# EAGLE design HEA (EAGLE 9.6.2)
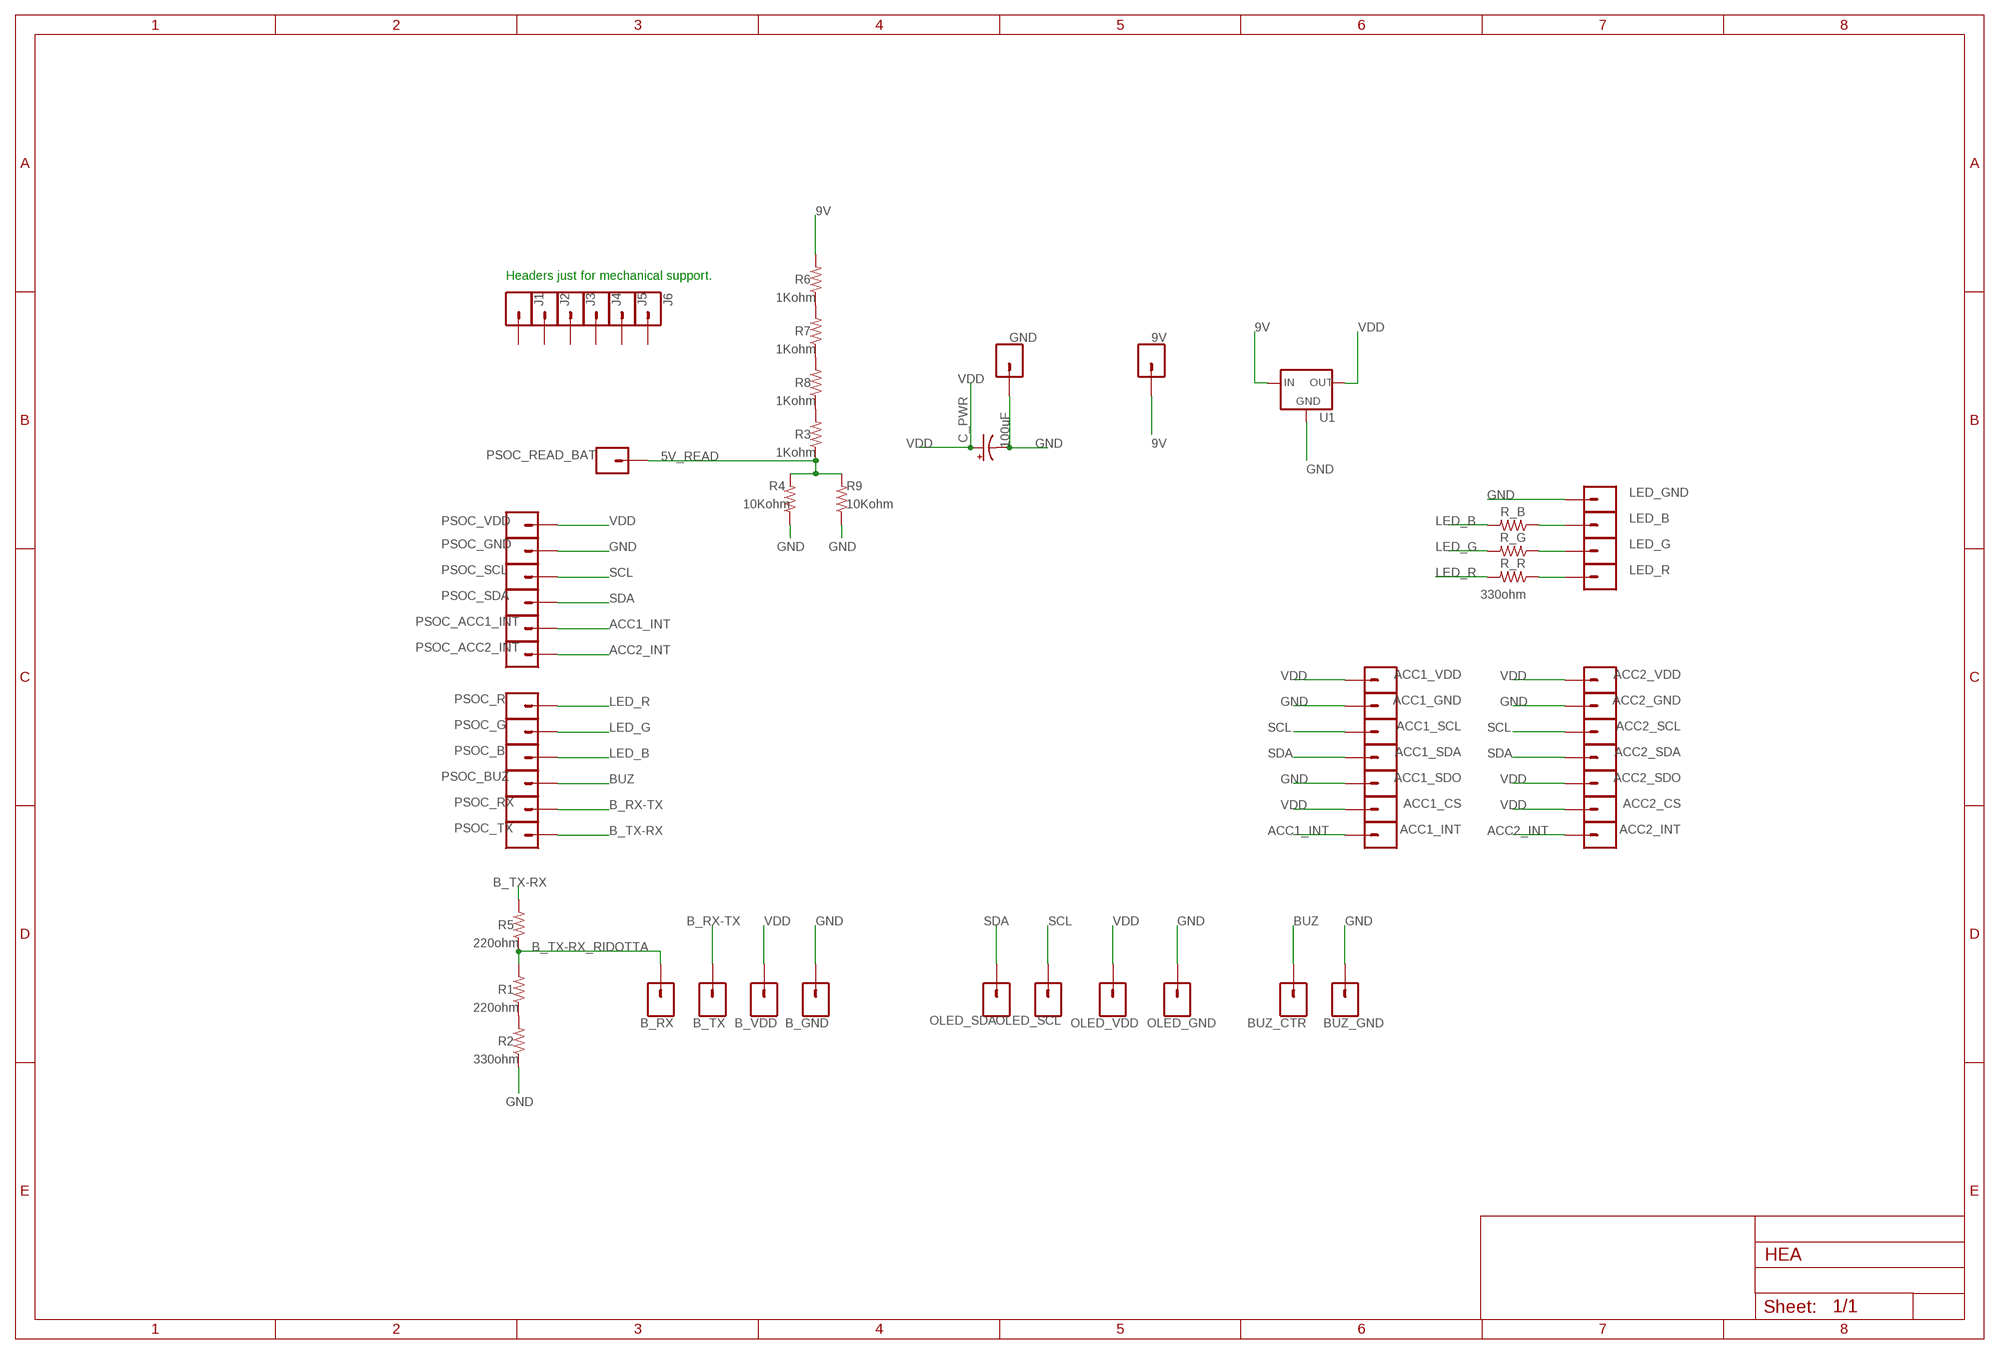
[diagram p0: schematic, sheet 1]

## Parts
9V  CONN_01  [1X01]
ACC1_CS  CONN_01  [1X01]
ACC1_GND  CONN_01  [1X01]
ACC1_INT  CONN_01  [1X01]
ACC1_SCL  CONN_01  [1X01]
ACC1_SDA  CONN_01  [1X01]
ACC1_SDO  CONN_01  [1X01]
ACC1_VDD  CONN_01  [1X01]
ACC2_CS  CONN_01  [1X01]
ACC2_GND  CONN_01  [1X01]
ACC2_INT  CONN_01  [1X01]
ACC2_SCL  CONN_01  [1X01]
ACC2_SDA  CONN_01  [1X01]
ACC2_SDO  CONN_01  [1X01]
ACC2_VDD  CONN_01  [1X01]
B_GND  CONN_01  [1X01]
B_RX  CONN_01  [1X01]
B_TX  CONN_01  [1X01]
B_VDD  CONN_01  [1X01]
BUZ_CTR  CONN_01  [1X01]
BUZ_GND  CONN_01  [1X01]
C_PWR  10uF  10UF-POLAR-RADIAL-2.5MM-25V-20%  [CPOL-RADIAL-2.5MM-5MM]
GND  CONN_01  [1X01]
J1  CONN_01  [1X01]
J2  CONN_01  [1X01]
J3  CONN_01  [1X01]
J4  CONN_01  [1X01]
J5  CONN_01  [1X01]
J6  CONN_01  [1X01]
LED_B  CONN_01  [1X01]
LED_G  CONN_01  [1X01]
LED_GND  CONN_01  [1X01]
LED_R  CONN_01  [1X01]
OLED_GND  CONN_01  [1X01]
OLED_SCL  CONN_01  [1X01]
OLED_SDA  CONN_01  [1X01]
OLED_VDD  CONN_01  [1X01]
PSOC_ACC1_INT  CONN_01  [1X01]
PSOC_ACC2_INT  CONN_01  [1X01]
PSOC_B  CONN_01  [1X01]
PSOC_BUZ  CONN_01  [1X01]
PSOC_G  CONN_01  [1X01]
PSOC_GND  CONN_01  [1X01]
PSOC_R  CONN_01  [1X01]
PSOC_READ_BAT  CONN_01  [1X01]
PSOC_RX  CONN_01  [1X01]
PSOC_SCL  CONN_01  [1X01]
PSOC_SDA  CONN_01  [1X01]
PSOC_TX  CONN_01  [1X01]
PSOC_VDD  CONN_01  [1X01]
R1  RESISTORAXIAL-0.3  [AXIAL-0.3]
R2  RESISTORAXIAL-0.3  [AXIAL-0.3]
R3  RESISTORAXIAL-0.3  [AXIAL-0.3]
R4  RESISTORAXIAL-0.3  [AXIAL-0.3]
R5  RESISTORAXIAL-0.3  [AXIAL-0.3]
R6  RESISTORAXIAL-0.3  [AXIAL-0.3]
R7  RESISTORAXIAL-0.3  [AXIAL-0.3]
R8  RESISTORAXIAL-0.3  [AXIAL-0.3]
R9  RESISTORAXIAL-0.3  [AXIAL-0.3]
R_B  RESISTORAXIAL-0.3  [AXIAL-0.3]
R_G  RESISTORAXIAL-0.3  [AXIAL-0.3]
R_R  RESISTORAXIAL-0.3  [AXIAL-0.3]
U1  V_REG_78XX-TO-220  [TO-220-ALT]

## Nets
5V_READ: PSOC_READ_BAT.1 R3.P$1 R4.P$2 R9.P$2
9V: 9V.1 R6.P$2 U1.IN
ACC1_INT: ACC1_INT.1 PSOC_ACC1_INT.1
ACC2_INT: ACC2_INT.1 PSOC_ACC2_INT.1
B_RX-TX: B_TX.1 PSOC_RX.1
B_TX-RX: PSOC_TX.1 R5.P$2
B_TX-RX_RIDOTTA: B_RX.1 R1.P$2 R5.P$1
BUZ: BUZ_CTR.1 PSOC_BUZ.1
GND: ACC1_GND.1 ACC1_SDO.1 ACC2_GND.1 B_GND.1 BUZ_GND.1 C_PWR.2(-) GND.1 LED_GND.1 OLED_GND.1 PSOC_GND.1 R2.P$1 R4.P$1 R9.P$1 U1.GND
LED_B: PSOC_B.1 R_B.P$2
LED_G: PSOC_G.1 R_G.P$2
LED_R: PSOC_R.1 R_R.P$2
N$1: R1.P$1 R2.P$2
N$2: R3.P$2 R8.P$1
N$3: LED_B.1 R_B.P$1
N$4: LED_G.1 R_G.P$1
N$5: LED_R.1 R_R.P$1
N$6: R7.P$1 R8.P$2
N$7: R6.P$1 R7.P$2
SCL: ACC1_SCL.1 ACC2_SCL.1 OLED_SCL.1 PSOC_SCL.1
SDA: ACC1_SDA.1 ACC2_SDA.1 OLED_SDA.1 PSOC_SDA.1
VDD: ACC1_CS.1 ACC1_VDD.1 ACC2_CS.1 ACC2_SDO.1 ACC2_VDD.1 B_VDD.1 C_PWR.1(+) OLED_VDD.1 PSOC_VDD.1 U1.OUT
Unconnected: J1.1 J2.1 J3.1 J4.1 J5.1 J6.1

## Notes on the sheet
- Headers just for mechanical support.

## Library data of the parts
9V ACC1_CS ACC1_GND ACC1_INT ACC1_SCL ACC1_SDA ACC1_SDO ACC1_VDD ACC2_CS ACC2_GND ACC2_INT ACC2_SCL ACC2_SDA ACC2_SDO ACC2_VDD B_GND B_RX B_TX B_VDD BUZ_CTR BUZ_GND GND J1-J6 LED_B LED_G LED_GND LED_R OLED_GND OLED_SCL OLED_SDA OLED_VDD PSOC_ACC1_INT PSOC_ACC2_INT PSOC_B PSOC_BUZ PSOC_G PSOC_GND PSOC_R PSOC_READ_BAT PSOC_RX PSOC_SCL PSOC_SDA PSOC_TX PSOC_VDD = SparkFun-Connectors:CONN_01: Single connection point. Often used as Generic Header-pin footprint for 0.1 inch spaced/style header connections On any of the 0.1 inch spaced packages, you can populate with these: Break Away Headers - Straight <https://www.sparkfun.com/products/116> (PRT-00116) Break Away Male Headers - Right Angle <https://www.sparkfun.com/products/553> (PRT-00553) Female Headers <https://www.sparkfun.com/products/115> (PRT-00115) Break Away Headers - Machine Pin <https://www.sparkfun.com/products/117> (PRT-00117) Break Away Female Headers - Swiss Machine Pin <https://www.sparkfun.com/products/743> (PRT-00743) This device is also useful as a general connection point to wire up your design to another part of your project. Our various solder wires solder well into these plated through hole pads. Hook-Up Wire - Assortment (Stranded, 22 AWG) <https://www.sparkfun.com/products/11375> (PRT-11375) Hook-Up Wire - Assortment (Solid Core, 22 AWG) <https://www.sparkfun.com/products/11367> (PRT-11367) View the entire wire category on our website here <https://www.sparkfun.com/categories/141> Special notes: SMTSO-256-ET is a "flush mount" nut for a 4-40 screw. We mostly use this on specialty testbeds; it is a nice way to connect hardware to your PCB at an adjustable hieght. Also note, the SNAP packages are for using a snappable style connector. We sell a baggie of snaps and they are also used on two LilyPad designs: Snap Assortment - 30 pack (male and female) <https://www.sparkfun.com/products/11347> (DEV-11347) LilyPad Arduino SimpleSnap <https://www.sparkfun.com/products/10941> (DEV-10941) LilyPad SimpleSnap Protoboard <https://www.sparkfun.com/products/10940> (DEV-10940)
C_PWR = SparkFun-Capacitors:10UF-POLAR: 10.0µF polarized capacitors A capacitor is a passive two-terminal electrical component used to store electrical energy temporarily in an electric field.; CAPACITANCE: 100uF; PROD_ID: CAP-08440
R1 R5 = SparkFun-Resistors:RESISTOR: Generic Resistor Package; RESISTANCE: 220ohm
R2 = SparkFun-Resistors:RESISTOR: Generic Resistor Package; RESISTANCE: 330ohm
R3 R6-R8 = SparkFun-Resistors:RESISTOR: Generic Resistor Package; RESISTANCE: 1Kohm
R4 R9 = SparkFun-Resistors:RESISTOR: Generic Resistor Package; RESISTANCE: 10Kohm
R_B R_G = SparkFun-Resistors:RESISTOR: Generic Resistor Package
R_R = SparkFun-Resistors:RESISTOR: Generic Resistor Package; RESTISTANCE: 330ohm
U1 = SparkFun-IC-Power:V_REG_78XX: Voltage Regulator Standard 78xx regulator. IGO (Input Ground Output). Spark Fun Electronics SKU : COM-00107; PROD_ID: VREG-08450; SF_ID: COM-00107

## Board
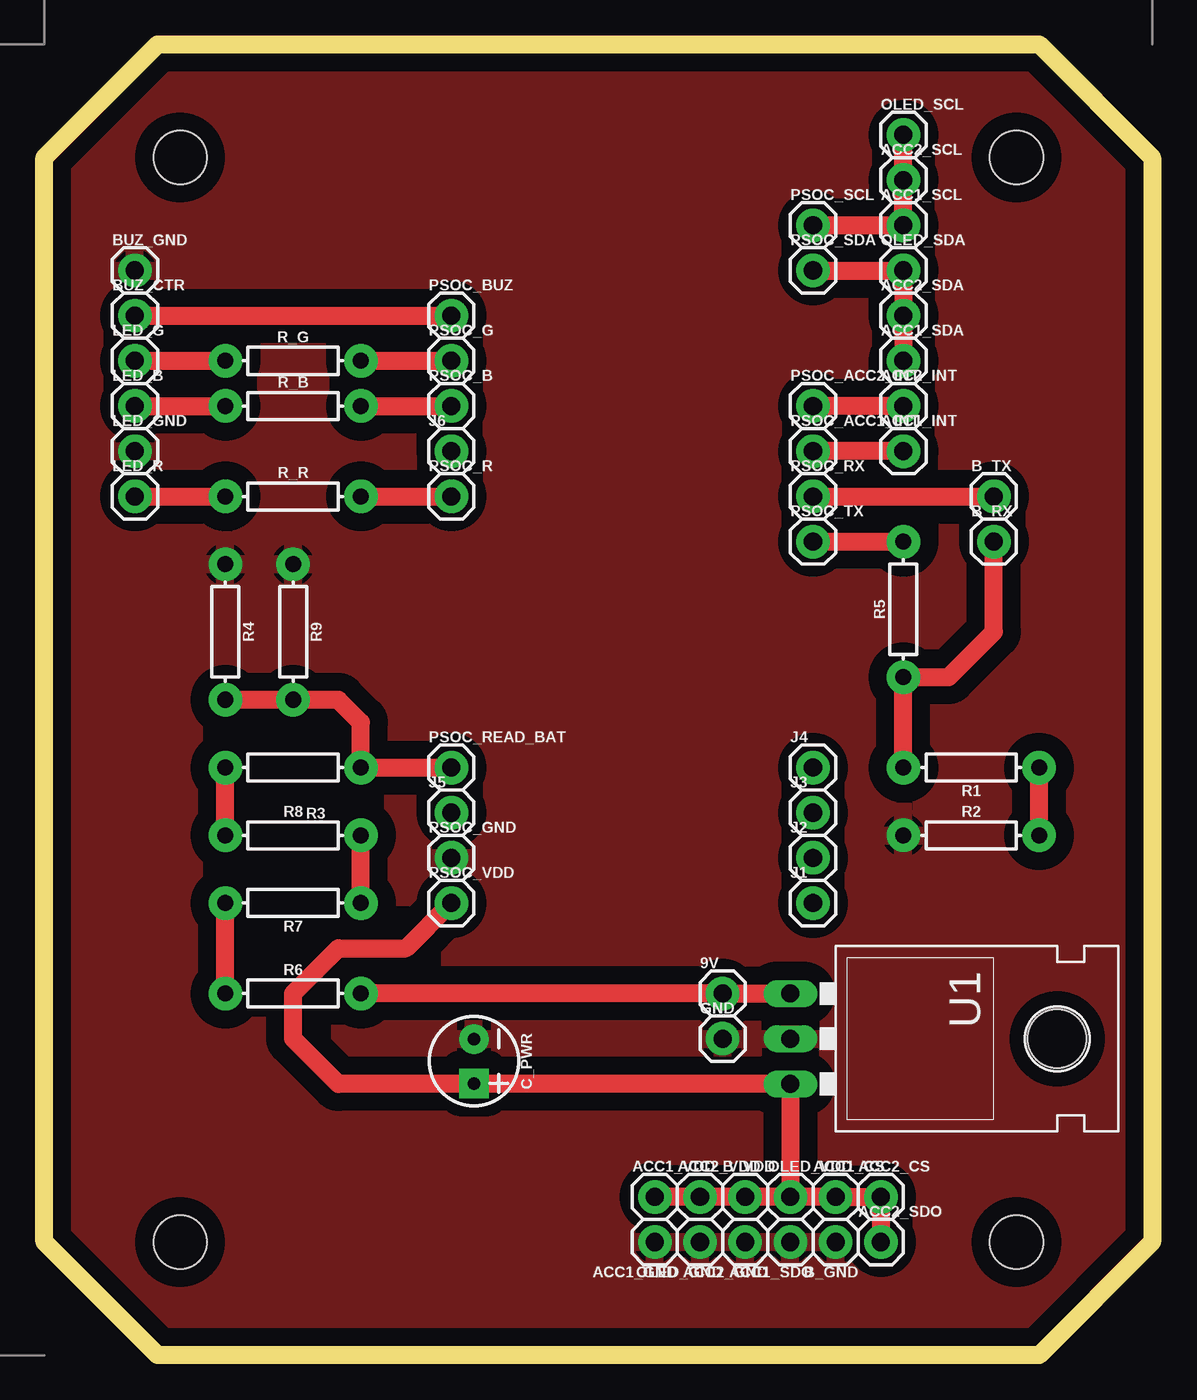
[diagram p1: board, top side]

Size 62.23 x 73.66 mm. Coordinates in mm from the lower left corner, seen from the top.
Outline: 6.35,73.66 55.88,73.66 62.23,67.31 62.23,6.35 55.88,0 6.35,0 0,6.35 0,67.31 6.35,73.66
Copper layers (1*16): Top 0.035mm / dielectric 1.5mm / Bottom 0.035mm
Design rules "default *": minimum track width 6mil, minimum drill 0.35mm, track to track 1mm, track to pad 6mil, pad to pad 6mil, via to via 6mil, smd to smd 6mil, copper to edge 40mil, drill to drill 6mil, minimum pad ring 10mil, minimum via ring 8mil, stop-mask expansion 4mil, vias tented up to drill 0mil, thermal gap 10mil
Holes 3 mm at 7.62,67.31 54.61,67.31 7.62,6.35 54.61,6.35

### Footprints (pad centres in the part's own frame; a part is rotated, then mirrored left to right if it is on the bottom)
1X01 = drill 1.016 pad 1.88: 1 0,0
CPOL-RADIAL-2.5MM-5MM = drill 0.7 pad 1.651 square: 1 1.25,0 | drill 0.7 pad 1.651: 2 -1.25,0
AXIAL-0.3 = drill 0.9 pad 1.88: P$1 -3.81,0; P$2 3.81,0
TO-220-ALT = drill 1.016 long: GND 0,-3.81; IN -2.54,-3.81; OUT 2.54,-3.81 | hole 3.302: 0,11.176

### Placement (x,y rotation side)
9V  38.1,20.32 0 top
ACC1_CS  44.45,8.89 0 top
ACC1_GND  34.29,6.35 180 top
ACC1_INT  48.26,50.8 0 top
ACC1_SCL  48.26,63.5 0 top
ACC1_SDA  48.26,55.88 0 top
ACC1_SDO  41.91,6.35 180 top
ACC1_VDD  34.29,8.89 0 top
ACC2_CS  46.99,8.89 0 top
ACC2_GND  39.37,6.35 180 top
ACC2_INT  48.26,53.34 0 top
ACC2_SCL  48.26,66.04 0 top
ACC2_SDA  48.26,58.42 0 top
ACC2_SDO  46.99,6.35 0 top
ACC2_VDD  36.83,8.89 0 top
B_GND  44.45,6.35 180 top
B_RX  53.34,45.72 0 top
B_TX  53.34,48.26 0 top
B_VDD  39.37,8.89 0 top
BUZ_CTR  5.08,58.42 0 top
BUZ_GND  5.08,60.96 0 top
C_PWR  24.13,16.51 270 top
GND  38.1,17.78 0 top
J1  43.18,25.4 0 top
J2  43.18,27.94 0 top
J3  43.18,30.48 0 top
J4  43.18,33.02 0 top
J5  22.86,30.48 0 top
J6  22.86,50.8 0 top
LED_B  5.08,53.34 0 top
LED_G  5.08,55.88 0 top
LED_GND  5.08,50.8 0 top
LED_R  5.08,48.26 0 top
OLED_GND  36.83,6.35 180 top
OLED_SCL  48.26,68.58 0 top
OLED_SDA  48.26,60.96 0 top
OLED_VDD  41.91,8.89 0 top
PSOC_ACC1_INT  43.18,50.8 0 top
PSOC_ACC2_INT  43.18,53.34 0 top
PSOC_B  22.86,53.34 0 top
PSOC_BUZ  22.86,58.42 0 top
PSOC_G  22.86,55.88 0 top
PSOC_GND  22.86,27.94 0 top
PSOC_R  22.86,48.26 0 top
PSOC_READ_BAT  22.86,33.02 0 top
PSOC_RX  43.18,48.26 0 top
PSOC_SCL  43.18,63.5 0 top
PSOC_SDA  43.18,60.96 0 top
PSOC_TX  43.18,45.72 0 top
PSOC_VDD  22.86,25.4 0 top
R1  52.07,33.02 180 top
R2  52.07,29.21 0 top
R3  13.97,33.02 180 top
R4  10.16,40.64 270 top
R5  48.26,41.91 90 top
R6  13.97,20.32 0 top
R7  13.97,25.4 180 top
R8  13.97,29.21 0 top
R9  13.97,40.64 270 top
R_B  13.97,53.34 0 top
R_G  13.97,55.88 0 top
R_R  13.97,48.26 0 top
U1  45.72,17.78 270 top

### Tracks (layer width: path | path; a pad name or v marks a point on that pad's centre or on a via)
5V_READ
  Top 1.016: PSOC_READ_BAT.1 R3.P$1 17.78,35.56 16.51,36.83 R9.P$2 R4.P$2
9V
  Top 1.016: U1.IN 9V.1 R6.P$2
ACC1_INT
  Top 1.016: ACC1_INT.1 PSOC_ACC1_INT.1
ACC2_INT
  Top 1.016: ACC2_INT.1 PSOC_ACC2_INT.1
B_RX-TX
  Top 1.016: PSOC_RX.1 B_TX.1
B_TX-RX
  Top 1.016: PSOC_TX.1 R5.P$2
B_TX-RX_RIDOTTA
  Top 1.016: R1.P$2 R5.P$1 50.8,38.1 53.34,40.64 B_RX.1
BUZ
  Top 1.016: BUZ_CTR.1 PSOC_BUZ.1
GND
  pour Top (isolate 1.016): 62.23,67.31 62.23,6.35 55.88,0 6.35,0 0,6.35 0,67.31 6.35,73.66 55.88,73.66
LED_B
  Top 1.016: R_B.P$2 PSOC_B.1
LED_G
  Top 1.016: R_G.P$2 PSOC_G.1
LED_R
  Top 1.016: R_R.P$2 PSOC_R.1
N$1
  Top 1.016: R2.P$2 R1.P$1
N$2
  Top 1.016: R8.P$1 R3.P$2
N$3
  Top 1.016: LED_B.1 R_B.P$1
N$4
  Top 1.016: LED_G.1 R_G.P$1
N$5
  Top 1.016: LED_R.1 R_R.P$1
N$6
  Top 1.016: R7.P$1 R8.P$2
N$7
  Top 1.016: R6.P$1 R7.P$2
SCL
  Top 1.016: OLED_SCL.1 ACC2_SCL.1 ACC1_SCL.1 PSOC_SCL.1
SDA
  Top 1.016: PSOC_SDA.1 OLED_SDA.1 ACC2_SDA.1 ACC1_SDA.1
VDD
  Top 1.016: OLED_VDD.1 U1.OUT 24.15,15.24 C_PWR.1 24.11,15.24 16.51,15.24 13.97,17.78 13.97,20.32 16.51,22.86 20.32,22.86 PSOC_VDD.1 | ACC2_SDO.1 ACC2_CS.1 ACC1_CS.1 OLED_VDD.1 | OLED_VDD.1 B_VDD.1 ACC2_VDD.1 ACC1_VDD.1